# EasyEDA schematic schematics.json
TITLE: Sheet_1; REV: 1.0; Date: 2024-10-01; Sheet: 1/1; Drawn By: aaryavbehl; Company: Your Company
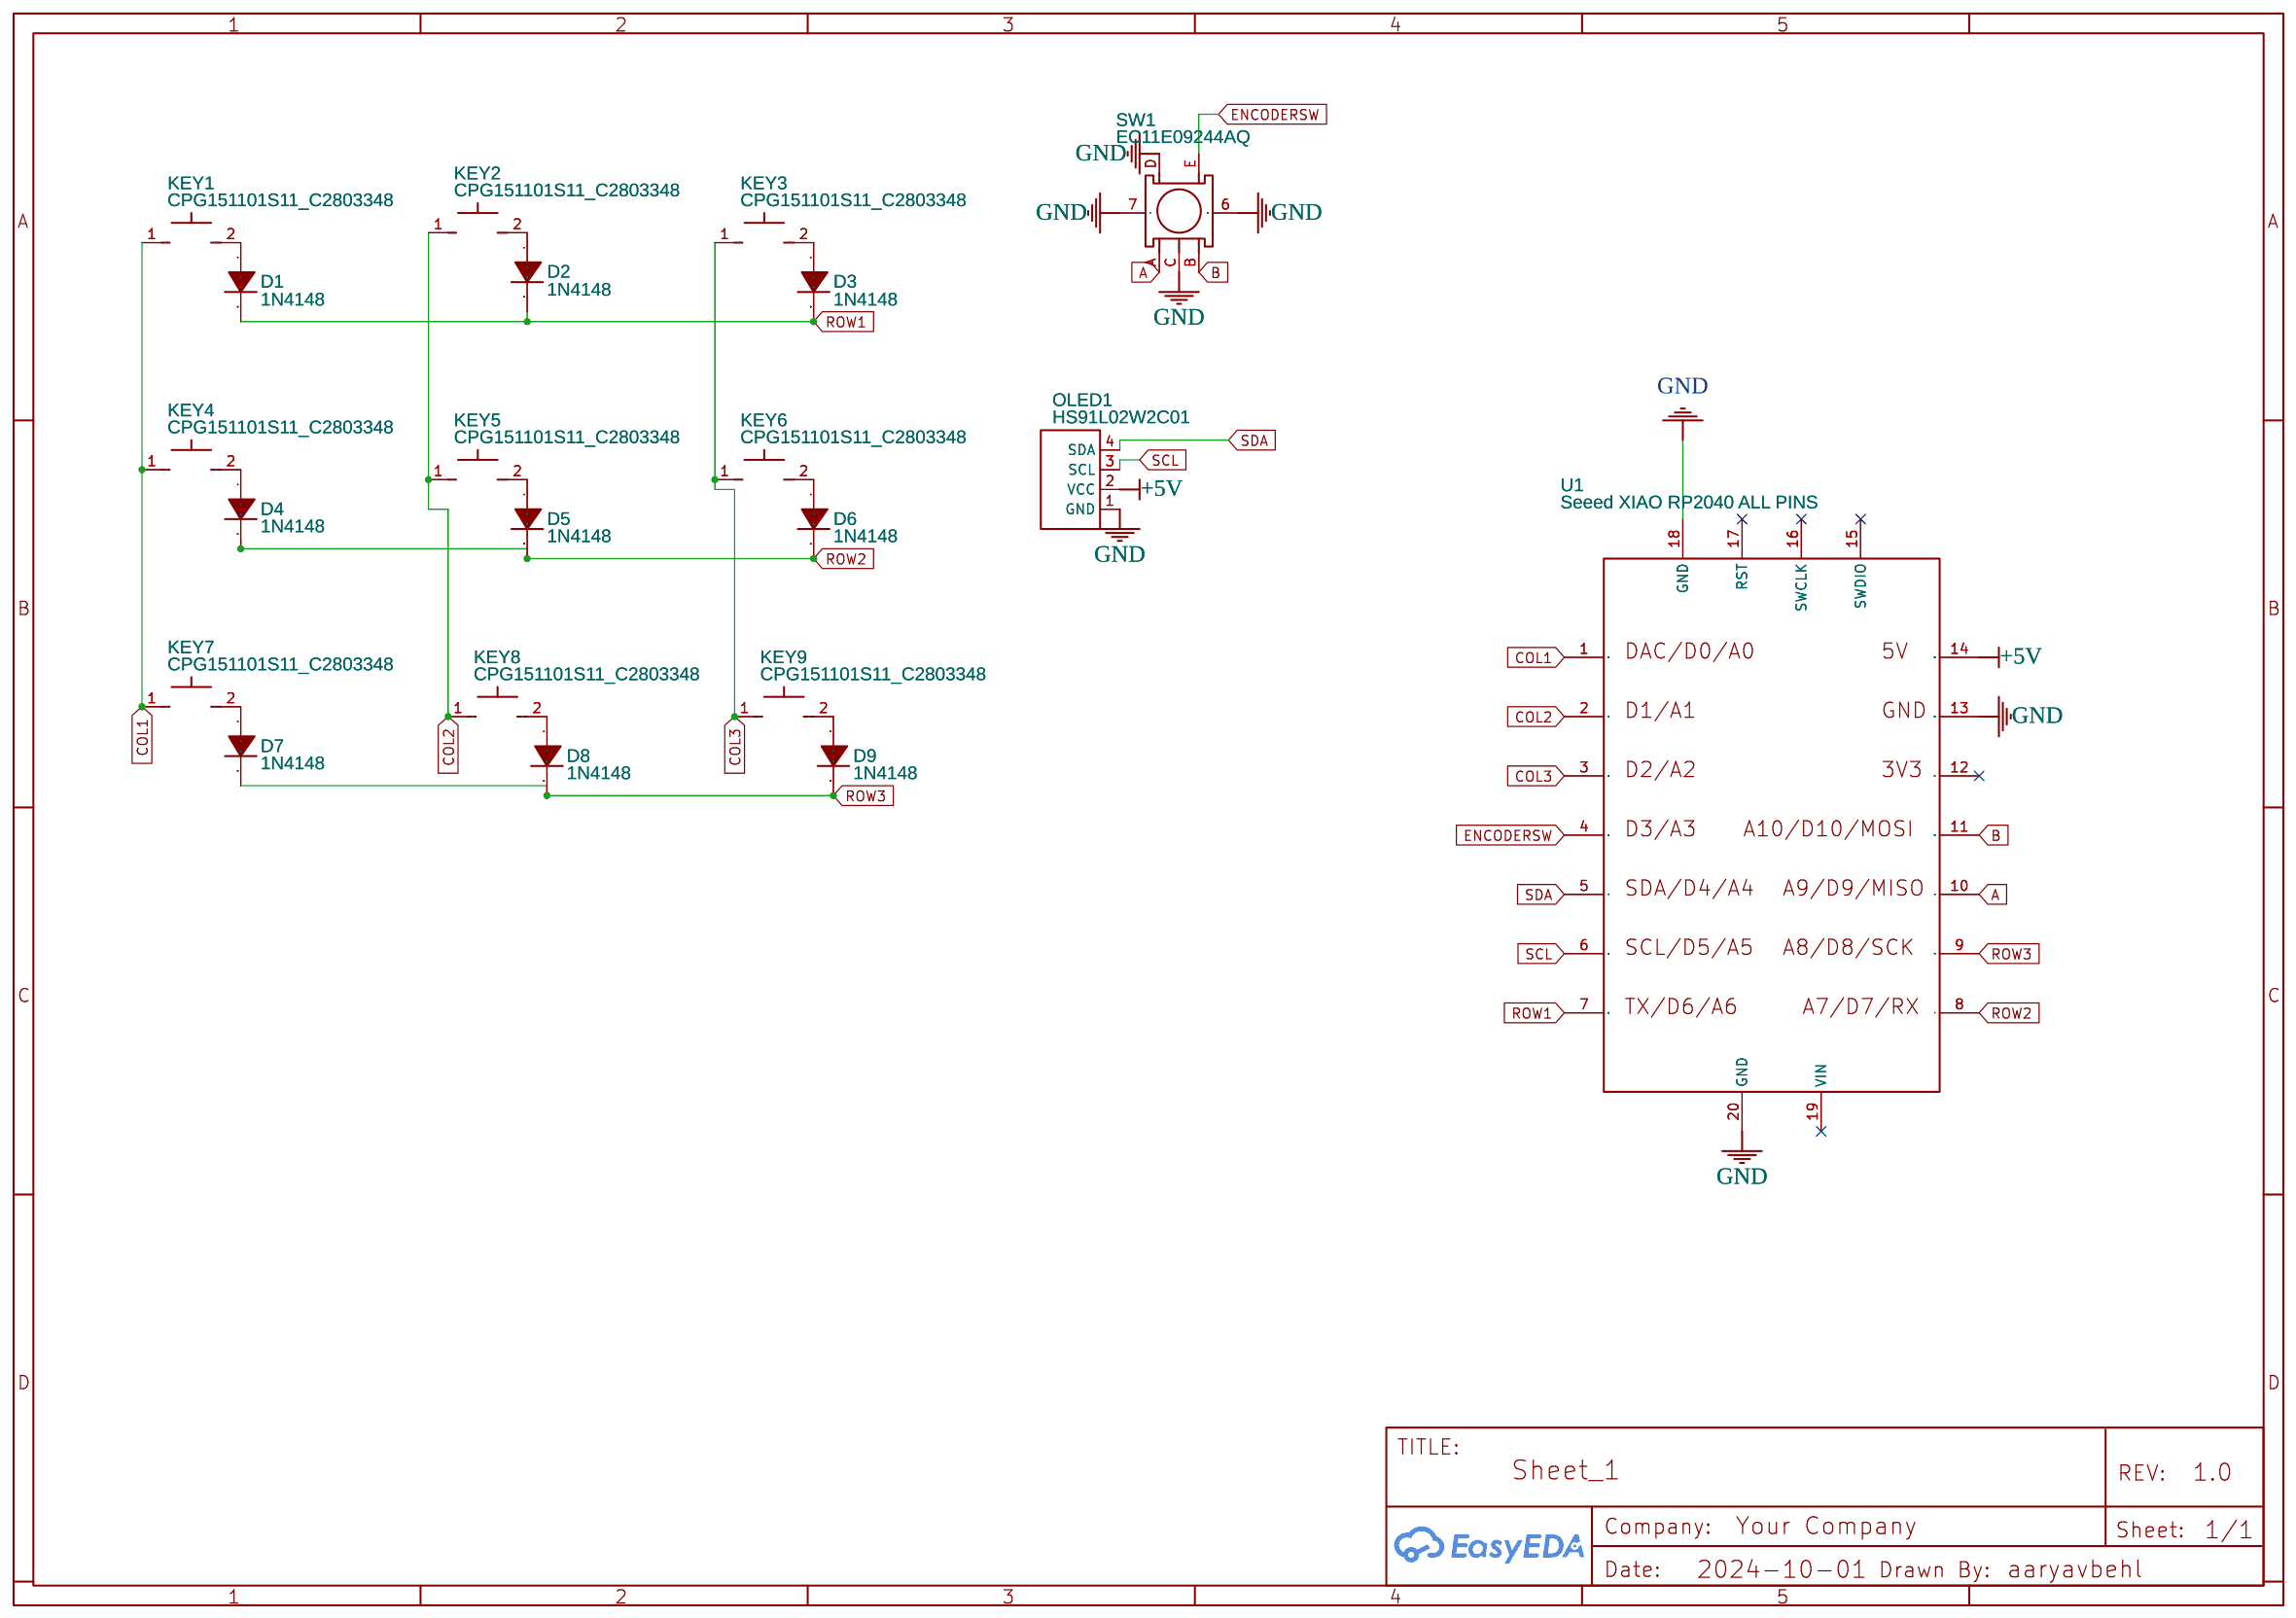
[diagram p0: schematic sheet]

## Parts
D1  1N4148  [DO-35_BD2.0-L4.0-P8.00-D0.5-FD]
D2  1N4148  [DO-35_BD2.0-L4.0-P8.00-D0.5-FD]
D3  1N4148  [DO-35_BD2.0-L4.0-P8.00-D0.5-FD]
D4  1N4148  [DO-35_BD2.0-L4.0-P8.00-D0.5-FD]
D5  1N4148  [DO-35_BD2.0-L4.0-P8.00-D0.5-FD]
D6  1N4148  [DO-35_BD2.0-L4.0-P8.00-D0.5-FD]
D7  1N4148  [DO-35_BD2.0-L4.0-P8.00-D0.5-FD]
D8  1N4148  [DO-35_BD2.0-L4.0-P8.00-D0.5-FD]
D9  1N4148  [DO-35_BD2.0-L4.0-P8.00-D0.5-FD]
KEY1  CPG151101S11_C2803348  [TH_L10.9-W5.9-CPG151101S11]
KEY2  CPG151101S11_C2803348  [TH_L10.9-W5.9-CPG151101S11]
KEY3  CPG151101S11_C2803348  [TH_L10.9-W5.9-CPG151101S11]
KEY4  CPG151101S11_C2803348  [TH_L10.9-W5.9-CPG151101S11]
KEY5  CPG151101S11_C2803348  [TH_L10.9-W5.9-CPG151101S11]
KEY6  CPG151101S11_C2803348  [TH_L10.9-W5.9-CPG151101S11]
KEY7  CPG151101S11_C2803348  [TH_L10.9-W5.9-CPG151101S11]
KEY8  CPG151101S11_C2803348  [TH_L10.9-W5.9-CPG151101S11]
KEY9  CPG151101S11_C2803348  [TH_L10.9-W5.9-CPG151101S11]
OLED1  HS91L02W2C01  [OLED-TH_L38.0-W12.0_HS91L02W2C01]
SW1  EC11E09244AQ  [SW-TH_EC11XXXXXXXX]
U1  Seeed XIAO RP2040 ALL PINS  [SEEED XIAO RP2040]

## Library data of the parts
D1-D9 = 1N4148: Supplier: LCSC; Manufacturer: ST(先科); Supplier Part: C14516; JLCPCB Part Class: Extended Part
KEY1-KEY9 = CPG151101S11_C2803348: Contributor: lcsc; Supplier: LCSC; Supplier Part: C2803348; Manufacturer: Kailh(凯华); Manufacturer Part: CPG151101S11; JLCPCB Part Class: Extended Part
OLED1 = HS91L02W2C01: Supplier: LCSC; Supplier Part: C5248081; Manufacturer: HS(汉昇); JLCPCB Part Class: Extended Part; Contributor: lcsc
SW1 = EC11E09244AQ: Contributor: LCSC; Supplier: LCSC; Supplier Part: C470753; Manufacturer: ALPSALPINE(阿尔卑斯阿尔派); JLCPCB Part Class: Extended Part
U1 = Seeed XIAO RP2040 ALL PINS: Manufacturer: Seeedstudio; Manufacturer Part: 102010328; link: https://www.seeedstudio.com/Seeeduino-XIAO-Arduino-Microcontroller-SAMD21-Cortex-M0+-p-4426.html; Contributor: mkyo2001

## Nets
+5V: OLED1.2(VCC) U1.14(13)
GND: OLED1.1(GND) SW1.6 SW1.7 SW1.C SW1.D U1.13(12) U1.18(GND) U1.20(GND)
A: SW1.A U1.10(9)
B: SW1.B U1.11(10)
COL1: KEY1.1 KEY4.1 KEY7.1 U1.1(0)
COL2: KEY2.1 KEY5.1 KEY8.1 U1.2(1)
COL3: KEY3.1 KEY6.1 KEY9.1 U1.3(2)
ENCODERSW: SW1.E U1.4(3)
ROW1: D1.2(C) D2.2(C) D3.2(C) U1.7(6)
ROW2: D4.2(C) D5.2(C) D6.2(C) U1.8(7)
ROW3: D7.2(C) D8.2(C) D9.2(C) U1.9(8)
SCL: OLED1.3(SCL) U1.6(5)
SDA: OLED1.4(SDA) U1.5(4)
Net-(D1-1): D1.1(A) KEY1.2
Net-(D2-1): D2.1(A) KEY2.2
Net-(D3-1): D3.1(A) KEY3.2
Net-(D4-1): D4.1(A) KEY4.2
Net-(D5-1): D5.1(A) KEY5.2
Net-(D6-1): D6.1(A) KEY6.2
Net-(D7-1): D7.1(A) KEY7.2
Net-(D8-1): D8.1(A) KEY8.2
Net-(D9-1): D9.1(A) KEY9.2

Not connected (* = marked no-connect by the designer): U1 12(11)* 15(SWDIO)* 16(SWCLK)* 17(RST)* 19(VIN)*
